# Altium schematic sheet DribblerInterface.SchDoc: Capteurs et moteur du dribbleur
size A4; Organization: Robocup Ulaval; DocumentNumber: 3; Revision: 1.0; SheetNumber: 3; SheetTotal: 10; Conceptor: Philippe T. Simon B. Léonard G. Alexia B-L.; Version: Gamma 1.0
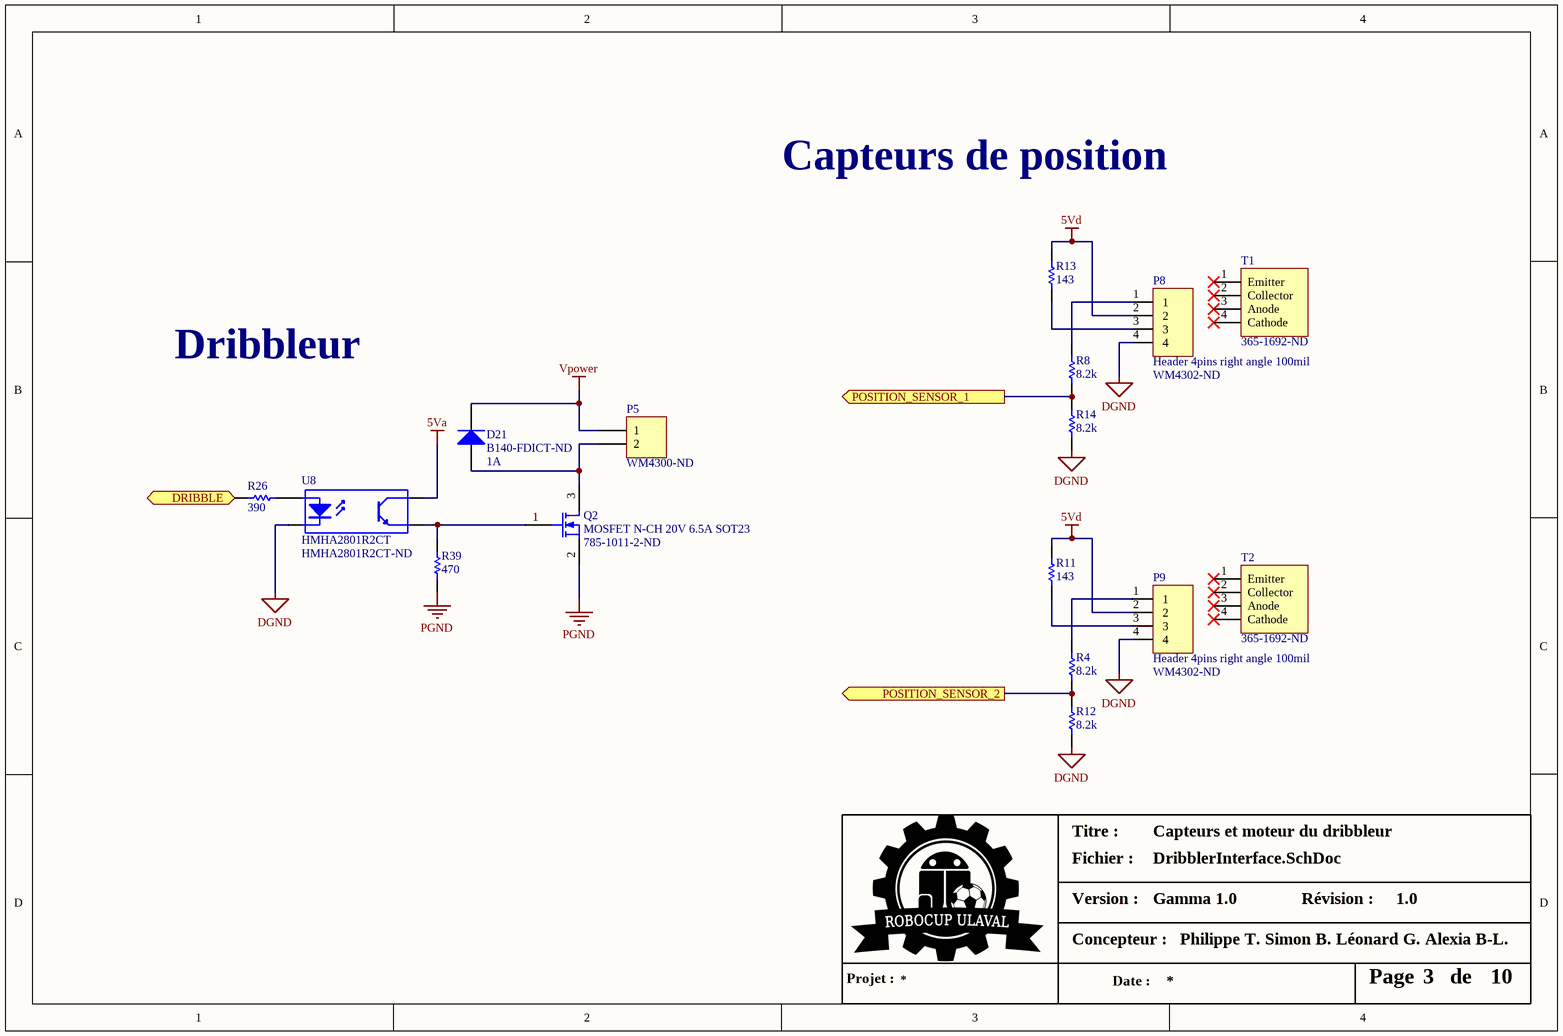
[diagram p0: DribblerInterface.SchDoc]

## Parts
D21  Supplier Part Number 1: B140-FDICT-ND  Current - Average Rectified (Io): 1A  [SMA]  (hidden comment: B140-13-F)
P5  Supplier Part Number 1: WM4300-ND  [0.156mil header right angle]  (hidden comment: Header 2 Right Angle)
P8  Header 4pins right angle 100mil  Supplier Part Number 1: WM4302-ND  [HDR1x4_Right_Angle]
P9  Header 4pins right angle 100mil  Supplier Part Number 1: WM4302-ND  [HDR1x4_Right_Angle]
Q2  MOSFET N-CH 20V 6.5A SOT23  Supplier Part Number 1: 785-1011-2-ND  [SOT-23-3]
R4  Resistance (Ohms): 8.2k  [0603]  (hidden comment: RC0603JR-078K2L)
R8  Resistance (Ohms): 8.2k  [0603]  (hidden comment: RC0603JR-078K2L)
R11  Resistance (Ohms): 143  [0603]  (hidden comment: RC0603FR-07143RL)
R12  Resistance (Ohms): 8.2k  [0603]  (hidden comment: RC0603JR-078K2L)
R13  Resistance (Ohms): 143  [0603]  (hidden comment: RC0603FR-07143RL)
R14  Resistance (Ohms): 8.2k  [0603]  (hidden comment: RC0603JR-078K2L)
R26  Resistance (Ohms): 390  [0603]  (hidden comment: RC0603JR-07390RL)
R39  Resistance (Ohms): 470  [0603]  (hidden comment: RC0603JR-07470RL)
T1  Supplier Part Number 1: 365-1692-ND  (hidden comment: OPB732WZ)
T2  Supplier Part Number 1: 365-1692-ND  (hidden comment: OPB732WZ)
U8  HMHA2801R2CT  Supplier Part Number 1: HMHA2801R2CT-ND  [SOIC127P700X220-4N]

## Ports
DRIBBLE (in), POSITION_SENSOR_1 (out), POSITION_SENSOR_2 (out)

## Nets
5Va: U8.4(C)
5Vd: P8.2 P9.2 R11.2 R13.2
DGND: P8.4 P9.4 R12.1 R14.1 U8.2(K)
PGND: Q2.2(S) R39.1
Vpower: D21.2(K) P5.1
DRIBBLE: R26.1 ; port DRIBBLE
POSITION_SENSOR_1: R8.1 R14.2 ; port POSITION_SENSOR_1
POSITION_SENSOR_2: R4.1 R12.2 ; port POSITION_SENSOR_2
NetD21_1: D21.1(A) P5.2 Q2.3(D)
NetP8_1: P8.1 R8.2
NetP8_3: P8.3 R13.1
NetP9_1: P9.1 R4.2
NetP9_3: P9.3 R11.1
NetQ2_1: Q2.1(G) R39.2 U8.3(E)
NetR26_2: R26.2 U8.1(A)

Not connected (* = marked no-connect by the designer): T1 1(Emitter)* 2(Collector)* 3(Anode)* 4(Cathode)*; T2 1(Emitter)* 2(Collector)* 3(Anode)* 4(Cathode)*

## Notes on the sheet
- Capteurs de position
- Dribbleur
- Titre :
- Version :
- Fichier :
- Révision :
- Projet :
- Concepteur :
- Date :
- Page
- de

## Library data of the parts
D21 = B140-13-F: DIODE SCHOTTKY 40V 1A SMA; Manufacturer: Diodes Incorporated; Voltage - Forward (Vf) (Max) @ If: 500mV @ 1A; Speed: Fast Recovery =< 500ns, > 200mA (Io); Current - Reverse Leakage @ Vr: 500µA @ 40V; Capacitance @ Vr, F: 110pF @ 4V, 1MHz; Supplier 1: Digi-Key; Manufacturer Part Number: B140-13-F; RoHS: RoHS Compliant; Category: Discrete Semiconductor Products; Stock 1: 278329; Pricing 1: 1=0.54, 10=0.441, 100=0.2337, 500=0.15366, 1000=0.1047 (CAD); Packaging: Cut Tape (CT); Diode Type: Schottky; Voltage - DC Reverse (Vr) (Max): 40V; Reverse Recovery Time (trr): -; Mounting Type: Surface Mount; Package / Case: DO-214AC, SMA; Supplier Device Package: SMA; Operating Temperature - Junction: -65°C ~ 150°C; ComponentLink1URL: http://www.diodes.com/_files/datasheets/ds13002.pdf; ComponentLink1Description: http://www.diodes.com/_files/datasheets/ds13002.pdf
P5 = Header 2pin 0.156 Right Angle: Header, 2-Pin, 0.156mil, Right Angle; Supplier 1: Digi-Key
Q2 = AO3416: Supplier 1: Digi-Key
R4 R8 R12 R14 = RC0603JR-078K2L: RES SMD 8.2K OHM 5% 1/10W 0603; Manufacturer: Yageo; Power (Watts): 0.1W, 1/10W; Temperature Coefficient: ±100ppm/°C; Supplier 1: Digi-Key; Supplier Part Number 1: 311-8.2KGRCT-ND; Manufacturer Part Number: RC0603JR-078K2L; RoHS: RoHS Compliant; Category: Resistors; Stock 1: 155277; Pricing 1: 1=0.15, 10=0.017, 25=0.012, 100=0.0067, 250=0.00508, 500=0.00408, 1000=0.003, 2500=0.0026 (CAD); Packaging: Cut Tape (CT); Tolerance: ±5%; Composition: Thick Film; Features: Moisture Resistant; Operating Temperature: -55°C ~ 155°C; Package / Case: 0603 (1608 Metric); Supplier Device Package: 0603; Size / Dimension: 0.063" L x 0.031" W (1.60mm x 0.80mm); Height: 0.022" (0.55mm); Number of Terminations: 2; ComponentLink1URL: http://www.yageo.com/documents/recent/PYu-RC_Group_51_RoHS_L_04.pdf; ComponentLink1Description: http://www.yageo.com/documents/recent/PYu-RC_Group_51_RoHS_L_04.pdf
R11 R13 = RC0603FR-07143RL: RES SMD 143 OHM 1% 1/10W 0603; Manufacturer: Yageo; Power (Watts): 0.1W, 1/10W; Temperature Coefficient: ±100ppm/°C; Supplier 1: Digi-Key; Manufacturer Part Number: RC0603FR-07143RL; RoHS: RoHS Compliant; Category: Resistors; Stock 1: 63239; Pricing 1: 1=0.15, 10=0.021, 25=0.0152, 100=0.0086, 250=0.0066, 500=0.00526, 1000=0.00389, 2500=0.00337 (CAD); Packaging: Cut Tape (CT); Tolerance: ±1%; Composition: Thick Film; Features: Moisture Resistant; Operating Temperature: -55°C ~ 155°C; Package / Case: 0603 (1608 Metric); Supplier Device Package: 0603; Size / Dimension: 0.063" L x 0.031" W (1.60mm x 0.80mm); Height: 0.022" (0.55mm); Number of Terminations: 2; ComponentLink1URL: http://www.yageo.com/documents/recent/PYu-RC_Group_51_RoHS_L_04.pdf; ComponentLink1Description: http://www.yageo.com/documents/recent/PYu-RC_Group_51_RoHS_L_04.pdf; Supplier Part Number 1: 311-143HRCT-ND
R26 = RC0603JR-07390RL: RES SMD 390 OHM 5% 1/10W 0603; Manufacturer: Yageo; Power (Watts): 0.1W, 1/10W; Temperature Coefficient: ±100ppm/°C; Supplier 1: Digi-Key; Manufacturer Part Number: RC0603JR-07390RL; RoHS: RoHS Compliant; Category: Resistors; Stock 1: 718727; Pricing 1: 1=0.15, 10=0.017, 25=0.012, 100=0.0067, 250=0.00508, 500=0.00408, 1000=0.003, 2500=0.0026 (CAD); Packaging: Cut Tape (CT); Tolerance: ±5%; Composition: Thick Film; Features: Moisture Resistant; Operating Temperature: -55°C ~ 155°C; Package / Case: 0603 (1608 Metric); Supplier Device Package: 0603; Size / Dimension: 0.063" L x 0.031" W (1.60mm x 0.80mm); Height: 0.022" (0.55mm); Number of Terminations: 2; ComponentLink1URL: http://www.yageo.com/documents/recent/PYu-RC_Group_51_RoHS_L_04.pdf; ComponentLink1Description: http://www.yageo.com/documents/recent/PYu-RC_Group_51_RoHS_L_04.pdf; Supplier Part Number 1: 311-390GRCT-ND
R39 = RC0603JR-07470RL: RES SMD 470 OHM 5% 1/10W 0603; Manufacturer: Yageo; Power (Watts): 0.1W, 1/10W; Temperature Coefficient: ±100ppm/°C; Supplier 1: Digi-Key; Manufacturer Part Number: RC0603JR-07470RL; RoHS: RoHS Compliant; Category: Resistors; Stock 1: 968246; Pricing 1: 1=0.15, 10=0.017, 25=0.012, 100=0.0067, 250=0.00508, 500=0.00408, 1000=0.003, 2500=0.0026 (CAD); Packaging: Cut Tape (CT); Tolerance: ±5%; Composition: Thick Film; Features: Moisture Resistant; Operating Temperature: -55°C ~ 155°C; Package / Case: 0603 (1608 Metric); Supplier Device Package: 0603; Size / Dimension: 0.063" L x 0.031" W (1.60mm x 0.80mm); Height: 0.022" (0.55mm); Number of Terminations: 2; ComponentLink1URL: http://www.yageo.com/documents/recent/PYu-RC_Group_51_RoHS_L_04.pdf; ComponentLink1Description: http://www.yageo.com/documents/recent/PYu-RC_Group_51_RoHS_L_04.pdf; Supplier Part Number 1: 311-470GRCT-ND
T1 T2 = OPB732WZ: SNSR OPTO TRANS 76.2MM REFL C-MT; Manufacturer: TT Electronics/Optek Technology; Sensing Distance: 3" (76.2mm); Sensing Method: Reflective; Voltage - Collector Emitter Breakdown (Max): 30V; Current - Collector (Ic) (Max): 50mA; Output Type: Phototransistor; Supplier 1: Digi-Key; Manufacturer Part Number: OPB732WZ; RoHS: RoHS Compliant; Category: Sensors, Transducers; Stock 1: 1115; Pricing 1: 1=6.54, 100=6.2843, 250=6.04264, 500=5.81512, 1000=5.6161, 2500=5.41704, 5000=5.2322 (CAD); Packaging: Bulk; Current - DC Forward (If) (Max): 50mA; Response Time: -; Mounting Type: Chassis Mount; Package / Case: Module, Pre-Wired; Operating Temperature: -40°C ~ 85°C; ComponentLink1URL: http://www.optekinc.com/datasheets/OPB732.PDF; ComponentLink1Description: http://www.optekinc.com/datasheets/OPB732.PDF
U8 = HMHA2801R2CT: OPTOISOLATOR 3.75KV TRANS 4-SO; Supplier 1: Digi-Key
P8 P9 = Header 4pins right angle 100mil: Supplier 1: Digi-Key